# Altium schematic sheet gmc507.SchDoc
size A; SheetNumber: 7; SheetTotal: 17
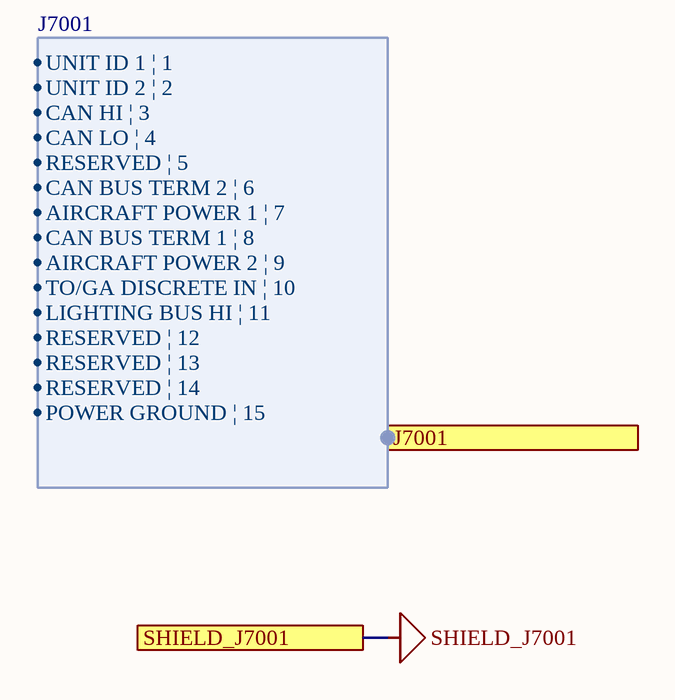
[diagram p0: gmc507.SchDoc]

## Ports
J7001 (harness J7001), SHIELD_J7001

## Harnesses
J7001: UNIT ID 1 | 1, UNIT ID 2 | 2, CAN HI | 3, CAN LO | 4, RESERVED | 5, CAN BUS TERM 2 | 6, AIRCRAFT POWER 1 | 7, CAN BUS TERM 1 | 8, AIRCRAFT POWER 2 | 9, TO/GA DISCRETE IN | 10, LIGHTING BUS HI | 11, RESERVED | 12, RESERVED | 13, RESERVED | 14, POWER GROUND | 15

## Nets
SHIELD_J7001: port SHIELD_J7001